# EAGLE design svetlo_ocelac (EAGLE 5.11)
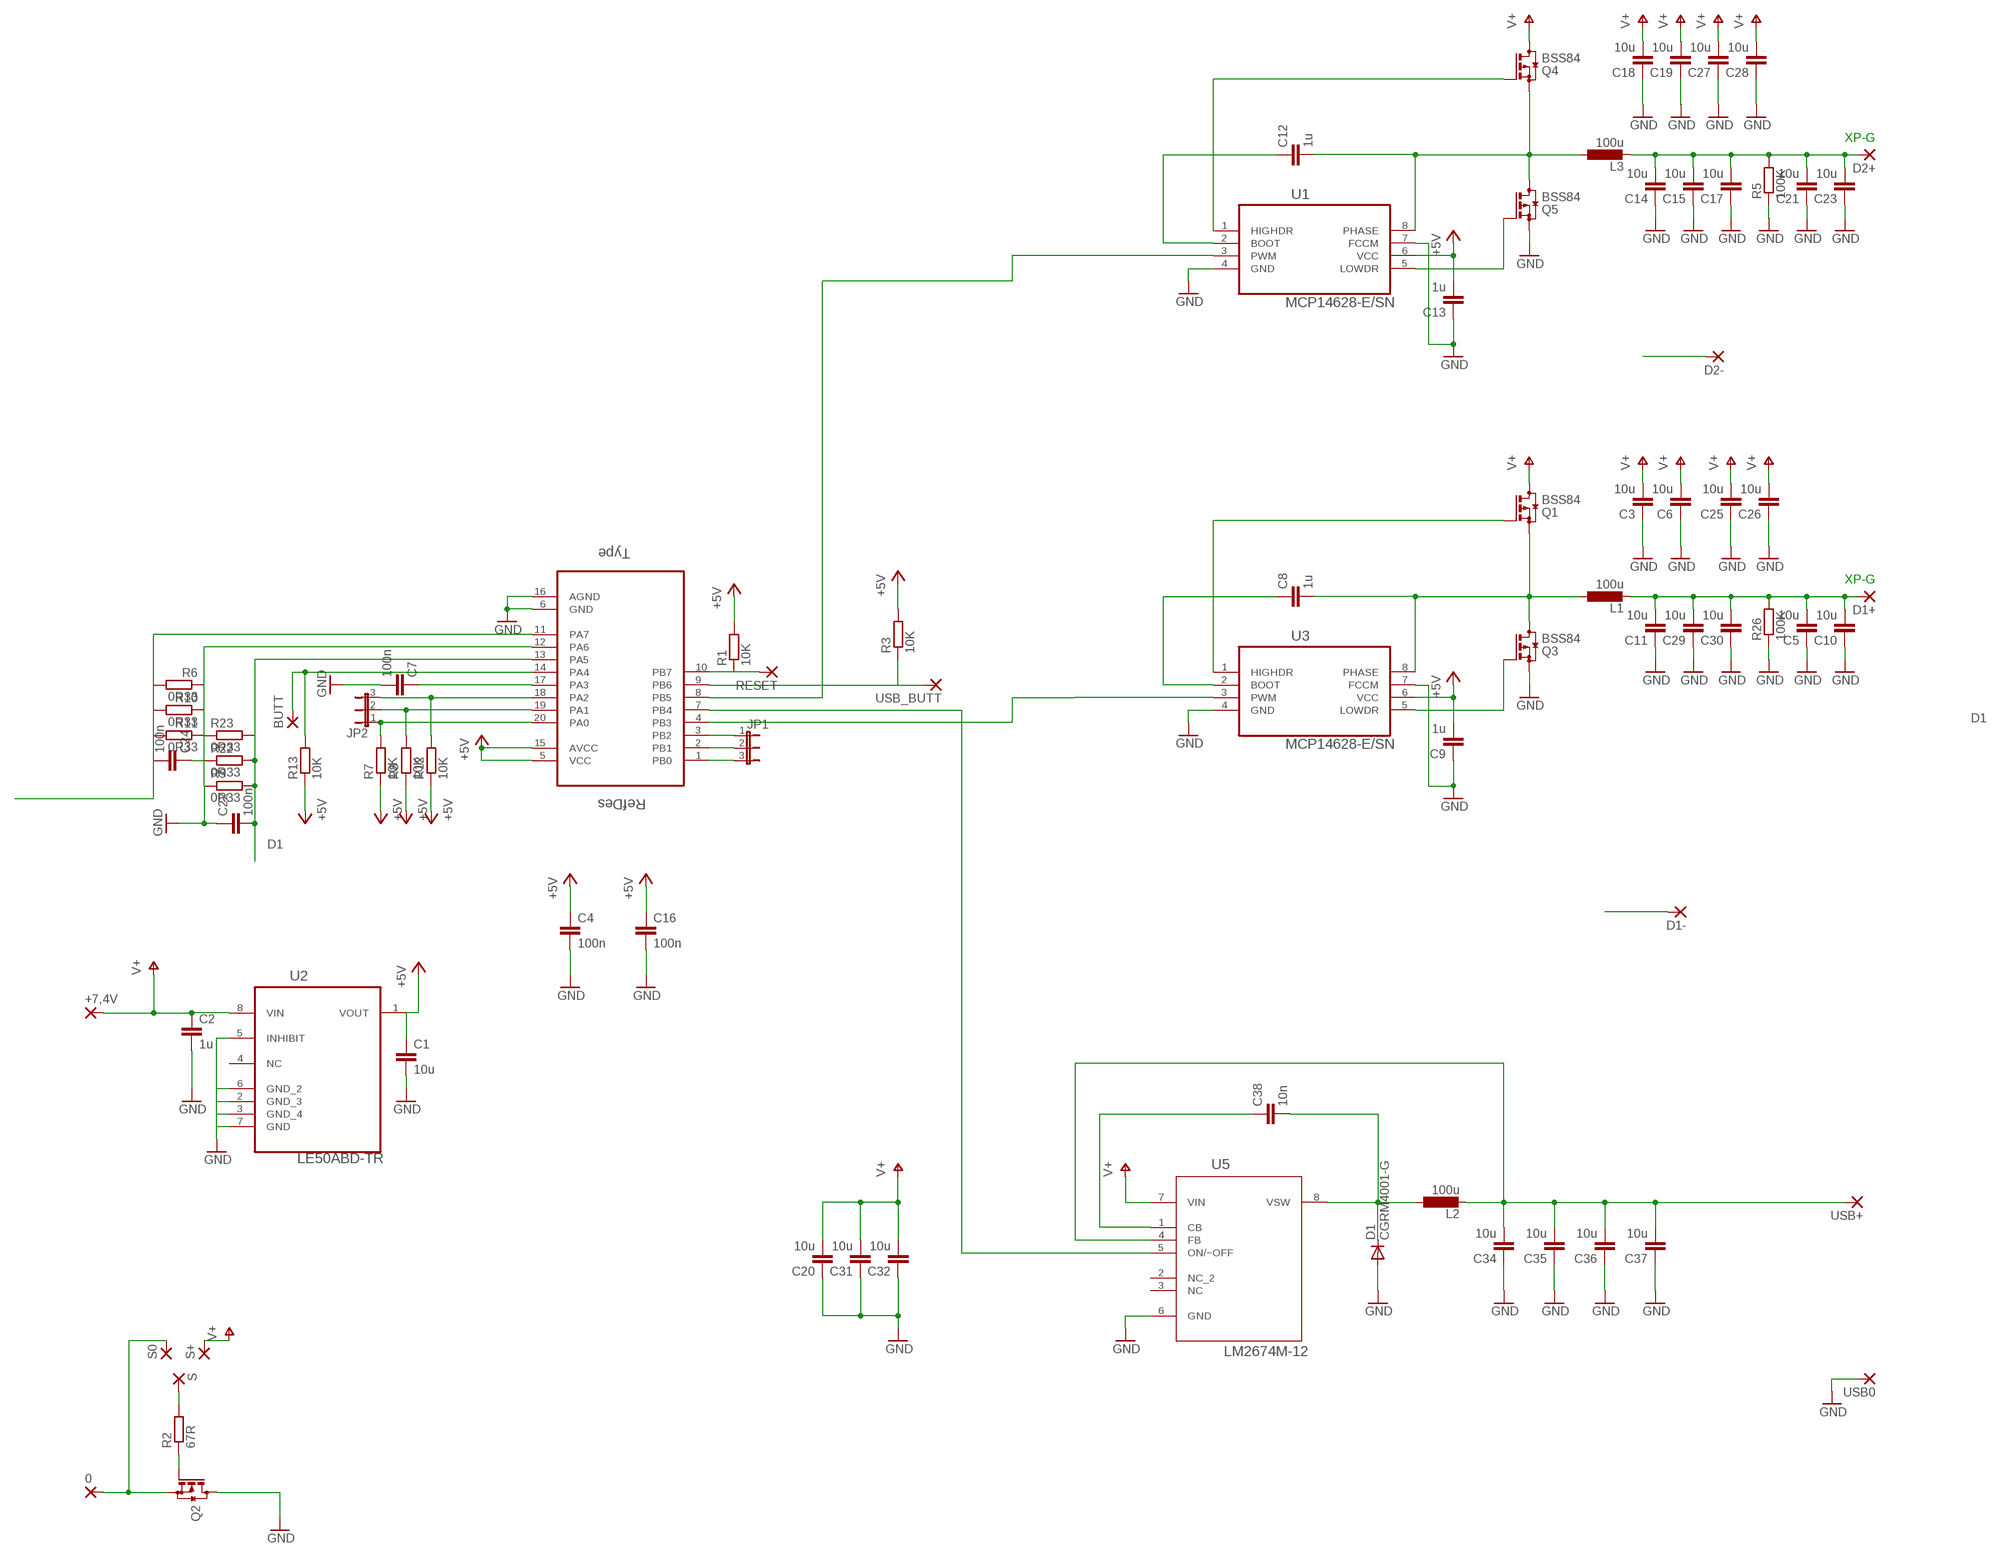
[diagram p0: schematic, sheet 1]

## Parts
0  3,81/1,4  [3,81/1,4]
+7,4V  3,81/1,4  [3,81/1,4]
BUTT  2,54/0,9  [2,54/0,9]
C1  10u  C-EUC1206  [C1206]
C2  1u  C-EUC1206  [C1206]
C3  10u  C-EUC1206  [C1206]
C4  100n  C-EUC0805  [C0805]
C5  10u  C-EUC1206  [C1206]
C6  10u  C-EUC1206  [C1206]
C7  100n  C-EUC0805  [C0805]
C8  1u  C-EUC1206  [C1206]
C9  1u  C-EUC1206  [C1206]
C10  10u  C-EUC1206  [C1206]
C11  10u  C-EUC1206  [C1206]
C12  1u  C-EUC1206  [C1206]
C13  1u  C-EUC1206  [C1206]
C14  10u  C-EUC1206  [C1206]
C15  10u  C-EUC1206  [C1206]
C16  100n  C-EUC0805  [C0805]
C17  10u  C-EUC1206  [C1206]
C18  10u  C-EUC1206  [C1206]
C19  10u  C-EUC1206  [C1206]
C20  10u  C-EUC1206  [C1206]
C21  10u  C-EUC1206  [C1206]
C22  100n  C-EUC0805  [C0805]
C23  10u  C-EUC1206  [C1206]
C24  100n  C-EUC0805  [C0805]
C25  10u  C-EUC1206  [C1206]
C26  10u  C-EUC1206  [C1206]
C27  10u  C-EUC1206  [C1206]
C28  10u  C-EUC1206  [C1206]
C29  10u  C-EUC1206  [C1206]
C30  10u  C-EUC1206  [C1206]
C31  10u  C-EUC1206  [C1206]
C32  10u  C-EUC1206  [C1206]
C34  10u  C-EUC1206  [C1206]
C35  10u  C-EUC1206  [C1206]
C36  10u  C-EUC1206  [C1206]
C37  10u  C-EUC1206  [C1206]
C38  10n  C-EUC0805  [C0805]
D1  CGRM4001-G  DIODE-DO-214AC  [DO-214AC]
D1+  3,81/1,4  [3,81/1,4]
D1-  3,81/1,4  [3,81/1,4]
D2+  3,81/1,4  [3,81/1,4]
D2-  3,81/1,4  [3,81/1,4]
JP1  JP2E  [JP2]
JP2  JP2E  [JP2]
L1  100u  L-EU0204/5  [0204/5]
L2  100u  L-EU0204/5  [0204/5]
L3  100u  L-EU0204/5  [0204/5]
Q1  BSS84  [SOT23]
Q2  BSS123  [SOT23]
Q3  BSS84  [SOT23]
Q4  BSS84  [SOT23]
Q5  BSS84  [SOT23]
R1  10K  R-EU_R0805  [R0805]
R2  67R  R-EU_R1206  [R1206]
R3  10K  R-EU_R0805  [R0805]
R5  100K  R-EU_R1206  [R1206]
R6  0R33  R-EU_R0805  [R0805]
R7  10K  R-EU_R0805  [R0805]
R8  10K  R-EU_R0805  [R0805]
R9  0R33  R-EU_R0805  [R0805]
R10  0R33  R-EU_R0805  [R0805]
R11  0R33  R-EU_R0805  [R0805]
R12  10K  R-EU_R0805  [R0805]
R13  10K  R-EU_R0805  [R0805]
R22  0R33  R-EU_R0805  [R0805]
R23  0R33  R-EU_R0805  [R0805]
R26  100K  R-EU_R1206  [R1206]
RESET  2,54/0,9  [2,54/0,9]
S  2,54/0,9  [2,54/0,9]
S0  2,54/0,9  [2,54/0,9]
S+  2,54/0,9  [2,54/0,9]
U1  MCP14628-E/SN  [SOIC127P600X175-8N]
U2  LE50ABD-TR  [SOIC127P600X175-8N]
U3  MCP14628-E/SN  [SOIC127P600X175-8N]
U4  ATTINY861A-SU  ATTINY861A-SUSOIC  [SOIC127P1032X265-20N]
U5  LM2674M-12  [SOIC127P620X175-8N]
USB0  2,54/0,9  [2,54/0,9]
USB+  2,54/0,9  [2,54/0,9]
USB_BUTT  2,54/0,9  [2,54/0,9]

## Nets
+5V: C1.1 C4.1 C9.2 C13.2 C16.1 R1.2 R3.2 R7.1 R8.1 R12.1 R13.1 U1.6(VCC) U2.1(VOUT) U3.6(VCC) U4.5(VCC) U4.15(AVCC)
D1: C22.2 D1-.1(P) R9.2 R22.2 R23.2 U4.13(PA5)
D2: C24.2 D2-.1(P) R6.2 R10.2 R11.2 U4.11(PA7)
GND: C1.2 C2.2 C3.1 C4.2 C5.1 C6.1 C7.2 C9.1 C10.1 C11.1 C13.1 C14.1 C15.1 C16.2 C17.1 C18.1 C19.1 C20.1 C21.1 C22.1 C23.1 C24.1 C25.1 C26.1 C27.1 C28.1 C29.1 C30.1 C31.1 C32.1 C34.1 C35.1 C36.1 C37.1 D1.A Q2.3(D) Q3.2(S) Q5.2(S) R5.1 R6.1 R9.1 R10.1 R11.1 R22.1 R23.1 R26.1 U1.4(GND) U1.7(FCCM) U2.2(GND_3) U2.3(GND_4) U2.5(INHIBIT) U2.6(GND_2) U2.7(GND) U3.4(GND) U3.7(FCCM) U4.6(GND) U4.12(PA6) U4.16(AGND) U5.6(GND) USB0.1(P)
N$1: R1.1 RESET.1(P) U4.10(PB7)
N$2: R2.2 S.1(P)
N$3: R3.1 U4.9(PB6) USB_BUTT.1(P)
N$4: Q3.1(G) U3.5(LOWDR)
N$5: C8.2 L1.1 Q1.2(S) Q3.3(D) U3.8(PHASE)
N$6: C5.2 C10.2 C11.2 C29.2 C30.2 D1+.1(P) L1.2 R26.2
N$7: Q2.1(G) R2.1
N$8: 0.1(P) Q2.2(S) S0.1(P)
N$9: U3.3(PWM) U4.4(PB3)
N$10: U1.3(PWM) U4.8(PB5)
N$11: C7.1 U4.17(PA3)
N$12: C14.2 C15.2 C17.2 C21.2 C23.2 D2+.1(P) L3.2 R5.2
N$13: C12.1 U1.2(BOOT)
N$14: Q5.1(G) U1.5(LOWDR)
N$15: C12.2 L3.1 Q4.2(S) Q5.3(D) U1.8(PHASE)
N$16: JP2.3 R12.2 U4.18(PA2)
N$17: Q4.1(G) U1.1(HIGHDR)
N$19: JP1.1 U4.3(PB2)
N$20: C8.1 U3.2(BOOT)
N$21: Q1.1(G) U3.1(HIGHDR)
N$22: JP1.2 U4.2(PB1)
N$23: JP1.3 U4.1(PB0)
N$24: JP2.2 R8.2 U4.19(PA1)
N$25: U4.7(PB4) U5.5(ON/~OFF)
N$26: C38.2 D1.C L2.1 U5.8(VSW)
N$27: C34.2 C35.2 C36.2 C37.2 L2.2 U5.4(FB) USB+.1(P)
N$28: C38.1 U5.1(CB)
N$29: JP2.1 R7.2 U4.20(PA0)
N$30: BUTT.1(P) R13.2 U4.14(PA4)
V+: +7,4V.1(P) C2.1 C3.2 C6.2 C18.2 C19.2 C20.2 C25.2 C26.2 C27.2 C28.2 C31.2 C32.2 Q1.3(D) Q4.3(D) S+.1(P) U2.8(VIN) U5.7(VIN)
Unconnected: U2.4(NC) U5.2(NC_2) U5.3(NC)

## Notes on the sheet
- XP-G
- XP-G

## Library data of the parts
0 +7,4V D1+ D1- D2+ D2- = wirepad:3,81/1,4: THROUGH-HOLE PAD
BUTT RESET S S0 S+ USB0 USB+ USB_BUTT = wirepad:2,54/0,9: THROUGH-HOLE PAD
C1-C32 C34-C38 = rcl:C-EU: CAPACITOR, European symbol
D1 = diode:DIODE-: DIODE
JP1 JP2 = jumper:JP2E: JUMPER
L1-L3 = rcl:L-EU: INDUCTOR, European symbol
Q1 Q3-Q5 = transistor-small-signal:BSS84: P-CHANNEL MOS FET
Q2 = transistor-small-signal:BSS123: N-CHANNEL MOS FET
R1-R3 R5-R13 R22 R23 R26 = rcl:R-EU_: RESISTOR, European symbol
U1 U3 = farnell:MCP14628-E/SN: MOSFET DRIVER, 2A, SYNC BUCK; MPN: MCP14628-E/SN; OC_FARNELL: 1629343; OC_NEWARK: 09P3985; PACKAGE: 8SOIC; SUPPLIER: Microchip
U2 = farnell:LE50ABD-TR: Very low drop voltage regulators with inhibit; MPN: LE50ABD-TR; OC_FARNELL: 1087176; OC_NEWARK: 26M0167; PACKAGE: SOIC-8; SUPPLIER: STMICROELECTRONICS
U4 = farnell:ATTINY861A-SU; DESCRIPTION: 8-bit Microcontroller with In-System Programmable Flash; MPN: ATTINY861A-SU; OC_FARNELL: 1841628; OC_NEWARK: 12T1344; PACKAGE: SOIC-20; SUPPLIER: Atmel
U5 = farnell:LM2674M-12: Step-Down Voltage Regulator; MPN: LM2674M-12; OC_FARNELL: 41K4119; OC_NEWARK: 1495086; PACKAGE: 8-SOIC; SUPPLIER: National Semiconductors

## Board
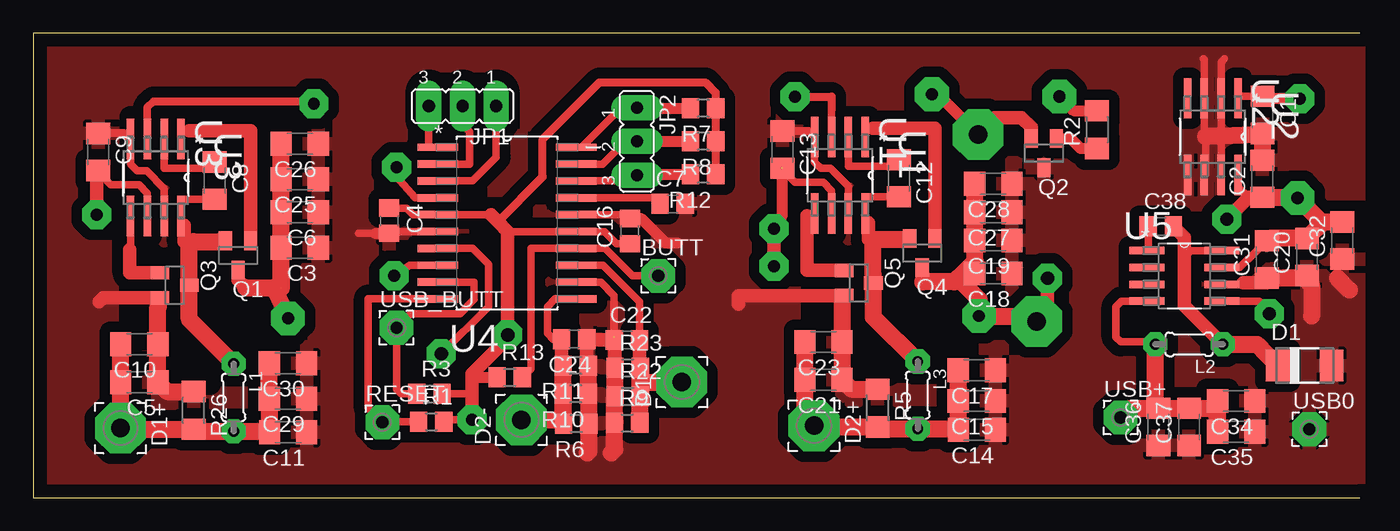
[diagram p1: board, top side]
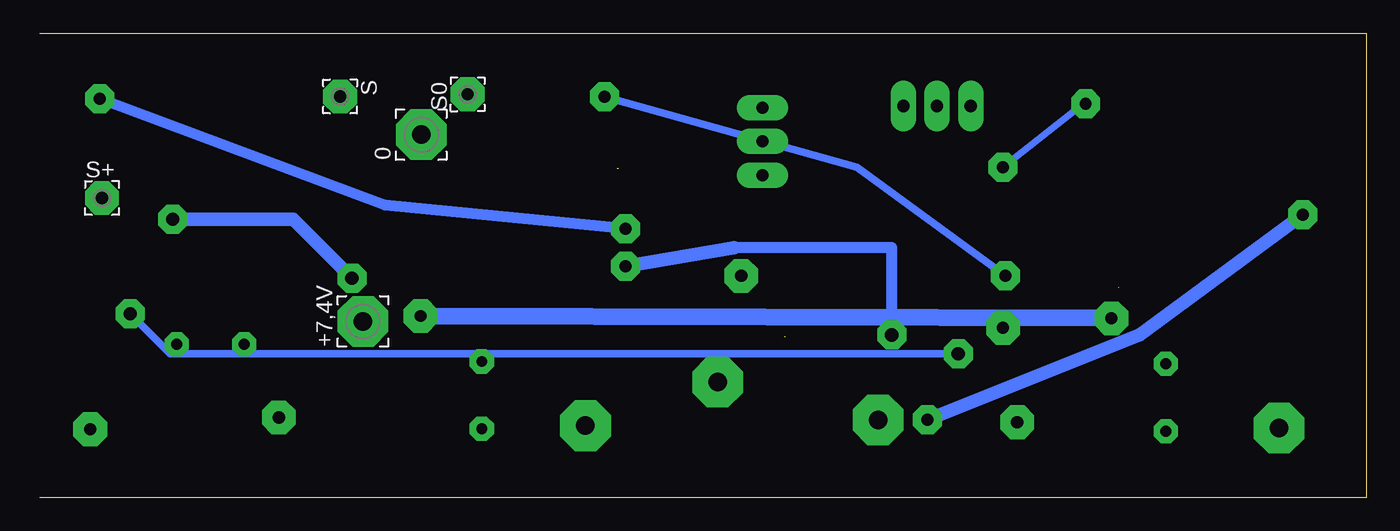
[diagram p2: board, bottom side, seen from below]

Size 100 x 35 mm. Coordinates in mm from the lower left corner, seen from the top.
Outline: 100,0 0,0 0,35 100,35
Copper layers (1*16): Top 0.035mm / dielectric 1.5mm / Bottom 0.035mm
Design rules "default *": minimum track width 10mil, minimum drill 24mil, track to track 12mil, track to pad 12mil, pad to pad 12mil, via to via 12mil, smd to smd 12mil, copper to edge 40mil, drill to drill 8mil, minimum pad ring 20mil, minimum via ring 20mil, stop-mask expansion 4mil, vias tented up to drill 0mil, thermal gap 10mil
tRestrict: area 7.3,23 to 8.7,28.7; area 58.9,23.2 to 60.3,28.9; area 61.7,9.2 to 64.5,11.7; area 10.5,8.5 to 13.3,12.1; area 7.3,11.9 to 10.3,16; area 58.7,13 to 61.2,16.5
bRestrict: area 16.5,49.8 to 17.8,50.5

### Footprints (pad centres in the part's own frame; a part is rotated, then mirrored left to right if it is on the bottom)
3,81/1,4 = drill 1.397 pad 3.81 octagon: 1 0,0
2,54/0,9 = drill 0.914 pad 2.54 octagon: 1 0,0
C1206 = smd 1.6 x 1.8: 1 -1.4,0; 2 1.4,0
C0805 = smd 1.3 x 1.5: 1 -0.95,0; 2 0.95,0
DO-214AC = smd 1.8 x 2.4: A 2.025,0; C -2.025,0
JP2 = drill 0.914 long: 1 -2.54,0; 2 0,0; 3 2.54,0
0204/5 = drill 0.813 octagon: 1 -2.54,0; 2 2.54,0
SOT23 = smd 1 x 1.4: 1 -0.95,-1.1; 2 0.95,-1.1; 3 0,1.1
R0805 = smd 1.3 x 1.5: 1 -0.95,0; 2 0.95,0
R1206 = smd 1.6 x 1.803: 1 -1.422,0; 2 1.422,0
SOIC127P600X175-8N = smd 3.048 x 0.559: 1 -2.896,1.905; 2 -2.896,0.635; 3 -2.896,-0.635; 4 -2.896,-1.905; 5 2.896,-1.905; 6 2.896,-0.635; 7 2.896,0.635; 8 2.896,1.905
SOIC127P1032X265-20N = smd 3.048 x 0.559: 1 -5.232,5.715; 2 -5.232,4.445; 3 -5.232,3.175; 4 -5.232,1.905; 5 -5.232,0.635; 6 -5.232,-0.635; 7 -5.232,-1.905; 8 -5.232,-3.175; 9 -5.232,-4.445; 10 -5.232,-5.715; 11 5.232,-5.715; 12 5.232,-4.445; 13 5.232,-3.175; 14 5.232,-1.905; 15 5.232,-0.635; 16 5.232,0.635; 17 5.232,1.905; 18 5.232,3.175; 19 5.232,4.445; 20 5.232,5.715
SOIC127P620X175-8N = smd 2.642 x 0.559: 1 -2.819,1.905; 2 -2.819,0.635; 3 -2.819,-0.635; 4 -2.819,-1.905; 5 2.819,-1.905; 6 2.819,-0.635; 7 2.819,0.635; 8 2.819,1.905

### Placement (x,y rotation side)
0  71.23,27.36 90 bottom
+7,4V  75.62,13.28 90 bottom
BUTT  47.12,16.71 0 top
C1  92.66,28.84 270 top
C2  92.65,24.03 90 top
C3  20.09,18.85 180 top
C4  26.84,20.87 270 top
C5  8,8.71 180 top
C6  20.09,21.51 180 top
C7  48.2,22.14 0 top
C8  13.68,23.89 270 top
C9  4.9,26.05 270 top
C10  8,11.56 180 top
C11  19.22,4.93 180 top
C12  65.24,24.07 270 top
C13  56.46,26.23 270 top
C14  71.13,5.11 180 top
C15  71.12,7.29 180 top
C16  44.98,20.09 90 top
C17  71.12,9.6 180 top
C18  72.36,16.89 180 top
C19  72.36,19.38 180 top
C20  96.01,18.14 90 top
C21  59.56,8.89 180 top
C22  44.75,11.88 0 top
C23  59.56,11.73 180 top
C24  40.78,11.94 180 top
C25  20.09,24 180 top
C26  20.09,26.67 180 top
C27  72.36,21.51 180 top
C28  72.36,23.65 180 top
C29  19.2,7.47 180 top
C30  19.2,10.13 180 top
C31  92.99,17.96 90 top
C32  98.68,19.38 90 top
C34  90.68,7.29 180 top
C35  90.68,4.98 180 top
C36  84.81,5.33 90 top
C37  87.12,5.33 90 top
C38  84.99,20.45 0 top
D1  95.83,9.96 0 top
D1+  6.58,5.25 270 top
D1-  48.9,8.71 90 top
D2+  58.85,5.42 270 top
D2-  36.8,5.87 90 top
JP1  32.36,29.51 180 top
JP2  45.52,26.85 270 top
L1  15.11,7.55 270 top
L2  87.12,11.56 180 top
L3  66.67,7.73 270 top
Q1  15.45,18.26 180 top
Q2  76.17,25.96 180 top
Q3  10.67,16 270 top
Q4  67.01,18.44 180 top
Q5  62.23,16.18 270 top
R1  30,5.72 0 top
R2  80.19,27.74 90 top
R3  29.87,7.82 0 top
R5  63.65,6.76 270 top
R6  40.93,5.57 180 top
R7  50.5,29.34 180 top
R8  50.5,26.85 180 top
R9  44.77,5.63 0 top
R10  40.89,7.82 180 top
R11  40.89,9.96 180 top
R12  50.5,24.36 180 top
R13  35.92,9.07 0 top
R22  44.81,7.65 0 top
R23  44.81,9.78 0 top
R26  12.09,6.58 270 top
RESET  26.31,5.69 0 top
S  77.34,30.23 270 bottom
S0  67.74,30.4 90 bottom
S+  95.3,22.58 0 bottom
U1  60.81,24.3 270 top
U2  88.9,27.2 270 top
U3  9.24,24.12 270 top
U4  35.72,20.69 0 top
U5  86.77,16.71 0 top
USB0  96.19,5.16 0 top
USB+  81.97,6.05 0 top
USB_BUTT  27.38,12.8 0 top

### Tracks (layer width: path | path; a pad name or v marks a point on that pad's centre or on a via)
+5V  (via drill 0.9 pad 2.18, 1 pad 2.18)  (1 unrouted)
  Top 0.254: 5.19,24.24 5.08,24.13 C9.2 | C13.2 56.34,24.31
  Top 0.559: U3.6 8.61,22.96 7.99,23.58 5.85,23.58 5.19,24.24 4.81,24.63 | U1.6 60.17,23.14 59.55,23.76 57.41,23.76 56.37,24.8 | C4.1 28.14,21.82 28.64,21.33 U4.5 34.5,21.33 | 35.77,20.06 U4.15 43.06,20.06 43.98,19.14 C16.1 | C1.1 90.84,30.24 U2.1 | v33.07,5.87 31.09,5.87 R1.2 | R3.2 32.72,7.82 33.07,7.47
  Top 0.61: R12.1 R8.1 R7.1 51.45,30.52 50.67,31.29 42.67,31.29 38.41,27.03 38.41,24.18 35.03,20.8
  Top 0.813: C13.2 56.46,21.26 v55.83,20.27 | v95.48,30.05 92.68,30.05 C1.1 | R13.1 33.07,9.07 33.07,9.25
  Top 1.016: 34.5,21.33 35.03,20.8 35.77,20.06 v35.77,12.27 35.77,12.03 33.07,9.33 33.07,9.25 33.07,7.47 v33.07,5.87 33.38,6.17 | v55.83,17.42 v55.83,20.27 | v4.8,21.34 4.8,24.55 C9.2
  Bottom 0.813: v55.83,20.27 73.97,22.05 v95.48,30.05 | 47.65,18.85 35.77,18.85 v35.77,12.27
  Bottom 1.016: 47.65,18.85 v55.83,17.42 | v33.07,5.87 17.07,12.27 v4.8,21.34
D1
  Top 0.559: U4.13 42.94,17.52 45.7,14.76 C22.2
  Top 1.016: R23.2 45.7,9.84 C22.2
  Top 1.27: R9.2 45.72,7.61 R22.2 45.76,8.53 | 45.76,8.53 R23.2 | D1-.1 45.93,8.71 45.76,8.53
D2
  Top 0.559: U4.11 39.34,14.98 38.76,14.4 38.76,12.38 39.2,11.94 C24.2
  Top 1.016: R11.2 39.83,10.07 C24.2
  Top 1.27: R6.2 39.94,5.96 R10.2 | R10.2 R11.2 | D2-.1 39.94,5.87 R10.2
GND  (1 unrouted)
  Top 0.559: 7.34,26.38 U3.4 7.34,25.12 7.83,24.63 8.54,24.63 9.88,23.29 U3.7 | 58.9,26.56 U1.4 58.9,25.29 59.39,24.8 60.1,24.8 61.44,23.46 U1.7 | U4.12 42.78,16.25 43.8,15.23 C22.1 | U2.6 88.37,24.41 88.37,27.2 88.27,27.3 U2.3 88.27,32.99 88.19,33.07 | 89.79,33.07 89.53,32.82 U2.2 U2.7 89.53,27.18 89.61,27.26 | U5.6 91.21,16.08 91.21,16.18 | U4.6 27.51,20.06 C4.2 | 24.54,19.91 25.79,19.92 | U4.16 44.7,21.33 C16.2
  Top 0.61: C9.1 6.91,27.45 U3.4 | C13.1 58.47,27.63 U1.4
  Top 0.813: 9.42,14.4 9.42,14.91 Q3.2 | 60.98,14.58 60.98,15.08 61.01,15.11 | 25.79,19.92 C4.2 | C16.2 45.81,21.04 47.65,19.2 48.54,19.2
  Top 1.016: Q3.2 5.27,15.05 4.98,14.76 | 61.01,15.11 Q5.2 53.16,15.23 53.16,14.58 | 91.21,16.18 92.99,16.18 C31.1 | 41.82,9.98 41.73,10.07 C24.1 | R23.1 43.86,12.02 43.79,12.09 43.61,11.91 41.6,11.91
  Top 1.27: C11.1 20.6,4.94 | R26.1 10.11,8 C5.1 C10.1 9.4,14.38 9.42,14.4 | C14.1 | R5.1 61.67,8.18 C21.1 C23.1 60.96,14.56 60.98,14.58 | R6.1 41.84,5.6 | 41.78,3.38 41.88,3.47 R6.1 | 43.56,3.38 43.82,3.64 R9.1 | C22.1 43.82,12.12 | R6.1 41.88,7.79 R10.1 R11.1 41.82,9.98 | R9.1 43.86,5.67 | R23.1 R22.1 43.82,7.61 R9.1 | R9.1 43.88,5.69 | C2.2 92.65,27.25 C1.2 89.61,27.26 88.42,27.26 88.37,27.2 | C31.1 95.83,16.56 | 95.83,16.56 C20.1 | 98.3,16.56 99.21,15.65 | 95.83,16.56 96.37,16.02 96.37,13.69
  pour Top (isolate 0.813): 0,35.03 99.92,35.03 99.92,0 0,0 0,34.85
N$1
  Top 0.559: U4.10 25.25,14.98 25.25,6.76 RESET.1 26.35,5.72 R1.1
N$2
  Top 0.813: R2.2 78.41,29.16 S.1
N$3
  Top 0.559: U4.9 33.25,16.25 33.25,14.94 32.18,13.87 28.45,13.87 USB_BUTT.1 27.38,8.18 27.74,7.82 R3.1
N$4
  Top 0.559: U3.5 7.34,18.72 7.29,18.67
  Top 1.016: 7.29,18.67 7.29,16.95 Q3.1
N$5
  Top 0.559: 11.38,20.54 11.15,20.54 U3.8 11.15,22.49 C8.2
  Top 1.016: Q1.2 14.05,19.36 14.05,19.29 | 11.74,16.63 11.77,16.63 Q3.3 | 11.38,20.54 11.38,19.29 12.1,19.29
  Top 1.27: 14.05,19.29 12.1,19.29 11.74,19.29 11.74,16.63 | Q3.3 11.77,13.43 L1.1
N$6
  Top 1.016: L1.2 15.11,5.16
  Top 1.27: 17.82,7.64 C11.2 17.73,5.01 L1.2 12.23,5.01 R26.2 6.67,5.16 | 17.82,7.64 17.82,8.16 C29.2 | C30.2 17.8,7.66 17.82,7.64 | 6.67,5.16 6.4,5.16 6.6,5.36 C5.2 C10.2 | D1+.1 6.67,5.16
N$7
  Top 0.813: Q2.1 78.2,27.06 78.94,26.31 R2.1
N$8
  Top 0.813: S0.1 68.18,30.4 0.1
  Top 1.016: Q2.2 75.22,27.9 74.5,28.63 72.5,28.63 0.1
N$9  (via drill 0.9 pad 2.18)
  Top 0.559: U4.4 28.79,22.6 27.38,24.18 v27.38,24.89 | v21.16,29.69 21.1,29.64 | U3.3 8.61,29.41 9.07,29.87
  Top 0.61: 9.07,29.87 21.16,29.87 v21.16,29.69
  Bottom 0.559: v27.38,24.89 21.34,29.69 v21.16,29.69
N$10  (via drill 0.9 pad 2.18)
  Top 0.559: 60.17,29.26 U1.3 | U4.8 28.36,17.52 v27.2,16.71
  Top 0.61: v57.43,30.23 60.17,30.23 60.17,29.26
  Bottom 0.559: v27.2,16.71 38.41,24.89 v57.43,30.23
N$11
  Top 0.559: U4.17 46.8,22.6 C7.1
N$12
  Top 1.016: L3.2 66.67,5.33
  Top 1.27: 69.73,7.82 C14.2 69.65,5.19 L3.2 63.8,5.19 R5.2 58.76,5.33 | 69.73,7.82 69.73,8.34 C15.2 | C17.2 69.72,7.84 69.73,7.82 | 58.76,5.33 57.96,5.33 58.16,5.54 C21.2 C23.2 | 58.76,5.33 D2+.1
N$13
  Top 0.559: U1.2 61.44,24.98 65.24,24.98 C12.1
  Top 0.61: 64.9,24.98 64.9,25.47 C12.1
N$14
  Top 0.559: 58.32,21.25 58.9,21.25 U1.5
  Top 1.016: Q5.1 58.32,17.13 58.32,21.25
N$15
  Top 0.559: 62.95,20.71 62.71,20.71 U1.8 62.71,22.67 C12.2
  Top 1.016: Q4.2 65.61,19.54 65.61,19.47 | 63.3,16.8 63.33,16.8 Q5.3 | 62.95,20.71 62.95,19.47 63.66,19.47
  Top 1.27: 65.61,19.47 63.66,19.47 63.3,19.47 63.3,16.8 | Q5.3 63.33,13.61 L3.1
N$16
  Top 0.559: U4.18 45.08,23.87 JP2.3
  Top 0.813: R12.2 45.57,24.36 JP2.3
N$17
  Top 0.559: U1.1 62.71,27.83 63.3,27.83
  Top 1.016: 63.3,27.83 67.96,27.83 Q4.1
N$19
  Top 0.559: U4.3 33.11,23.87 34.9,25.65 JP1.1
N$20
  Top 0.559: U3.2 9.88,24.8 13.68,24.8 C8.1
  Top 0.61: 13.34,24.8 13.34,25.29 C8.1
N$21
  Top 0.559: U3.1 11.15,27.65 11.74,27.65
  Top 1.016: 11.74,27.65 16.4,27.65 Q1.1
N$22
  Top 0.559: U4.2 32.89,25.14 32.89,27.56 32.36,28.09 JP1.2
N$23
  Top 0.559: U4.1 29.82,26.41 JP1.3
N$24
  Top 0.559: U4.19 42.92,25.14 44.45,26.67 45.34,26.67 JP2.2
  Top 0.813: JP2.2 R8.2
N$25  (via drill 1 pad 2.18)
  Top 0.559: U5.5 92.41,14.81 93.17,14.05 v93.17,13.87 | U4.7 33.13,18.79 34.31,17.6 34.31,14.4 v30.76,10.85
  Bottom 0.559: v30.76,10.85 90.14,10.85 v93.17,13.87
N$26
  Top 0.559: U5.8 87.25,18.62 86.77,18.14
  Top 1.016: L2.1 86.77,14.45 86.77,18.14 86.77,19.62 C38.2
  Top 1.27: L2.1 92.26,11.56 D1.C
N$27
  Top 0.559: U5.4 82.02,14.81 81.61,14.4 81.61,12.09 81.97,11.73 84.4,11.73 L2.2
  Top 1.27: L2.2 84.58,6.96 C36.2 | C36.2 C37.2 89.12,6.73 C35.2 C34.2 | USB+.1 82.66,6.73 C36.2
N$28
  Top 0.559: C38.1 84.04,18.71 U5.1
N$29
  Top 0.559: U4.20 41.34,26.41 44.27,29.34 45.47,29.34 JP2.1
  Top 0.813: R7.2 45.57,29.34 JP2.1
N$30
  Top 0.559: R13.2 37.52,9.72 37.52,18.79 U4.14 43.09,18.79 45.16,16.71 BUTT.1
V+  (via drill 0.9 pad 2.54, 1 pad 2.18)  (1 unrouted)
  Top 0.254: 18.69,16.51 19.05,16.51
  Top 0.559: 91.62,22.63 90.81,23.44 U2.8 | U5.7 90.96,17.35 91.57,17.96 91.59,17.96 C31.2
  Top 1.016: Q4.3 67.04,17.34 67.04,16.27 67.01,16.27 | 16,15.82 15.45,16.38 Q1.3 | C2.1 91.62,22.63 v89.97,20.98 | v76.45,16.54 76.45,14.47 +7,4V.1 | C31.2 92.99,19.02
  Top 1.27: C26.2 C25.2 18.53,23.84 18.69,23.84 C6.2 | C28.2 C27.2 70.97,17.84 70.98,17.82 | C19.2 70.98,17.76 70.98,17.82 | C18.2 70.23,16.89 70.14,16.98 | C2.1 95.25,22.63 S+.1 97.1,20.78 97.26,20.78 | 70.14,16.98 70.98,17.82 | 67.04,16.27 69.43,16.27 69.7,16.54 | C6.2 18.53,21.67 | C6.2 C3.2 18.69,16.51 18.69,15.8 | 69.7,16.54 70.14,16.98 | +7,4V.1 74.86,13.69 v71.3,13.69 71.3,14.94 69.7,16.54 | 18.14,15.82 18.67,15.82 | 18.14,15.82 v19.2,13.51 | 16,15.82 18.14,15.82 | v89.97,20.98 90.14,20.8 | 92.97,19.38 C31.2 93.17,19.54 C20.2 97.26,20.78 | 97.26,20.78 C32.2
  Bottom 1.016: v89.97,20.98 80.9,20.98 v76.45,16.54
  Bottom 1.27: v19.2,13.51 v71.3,13.69